# Altium schematic sheet Configuration_JTAG.SchDoc
size B; SheetNumber: 7; SheetTotal: 11
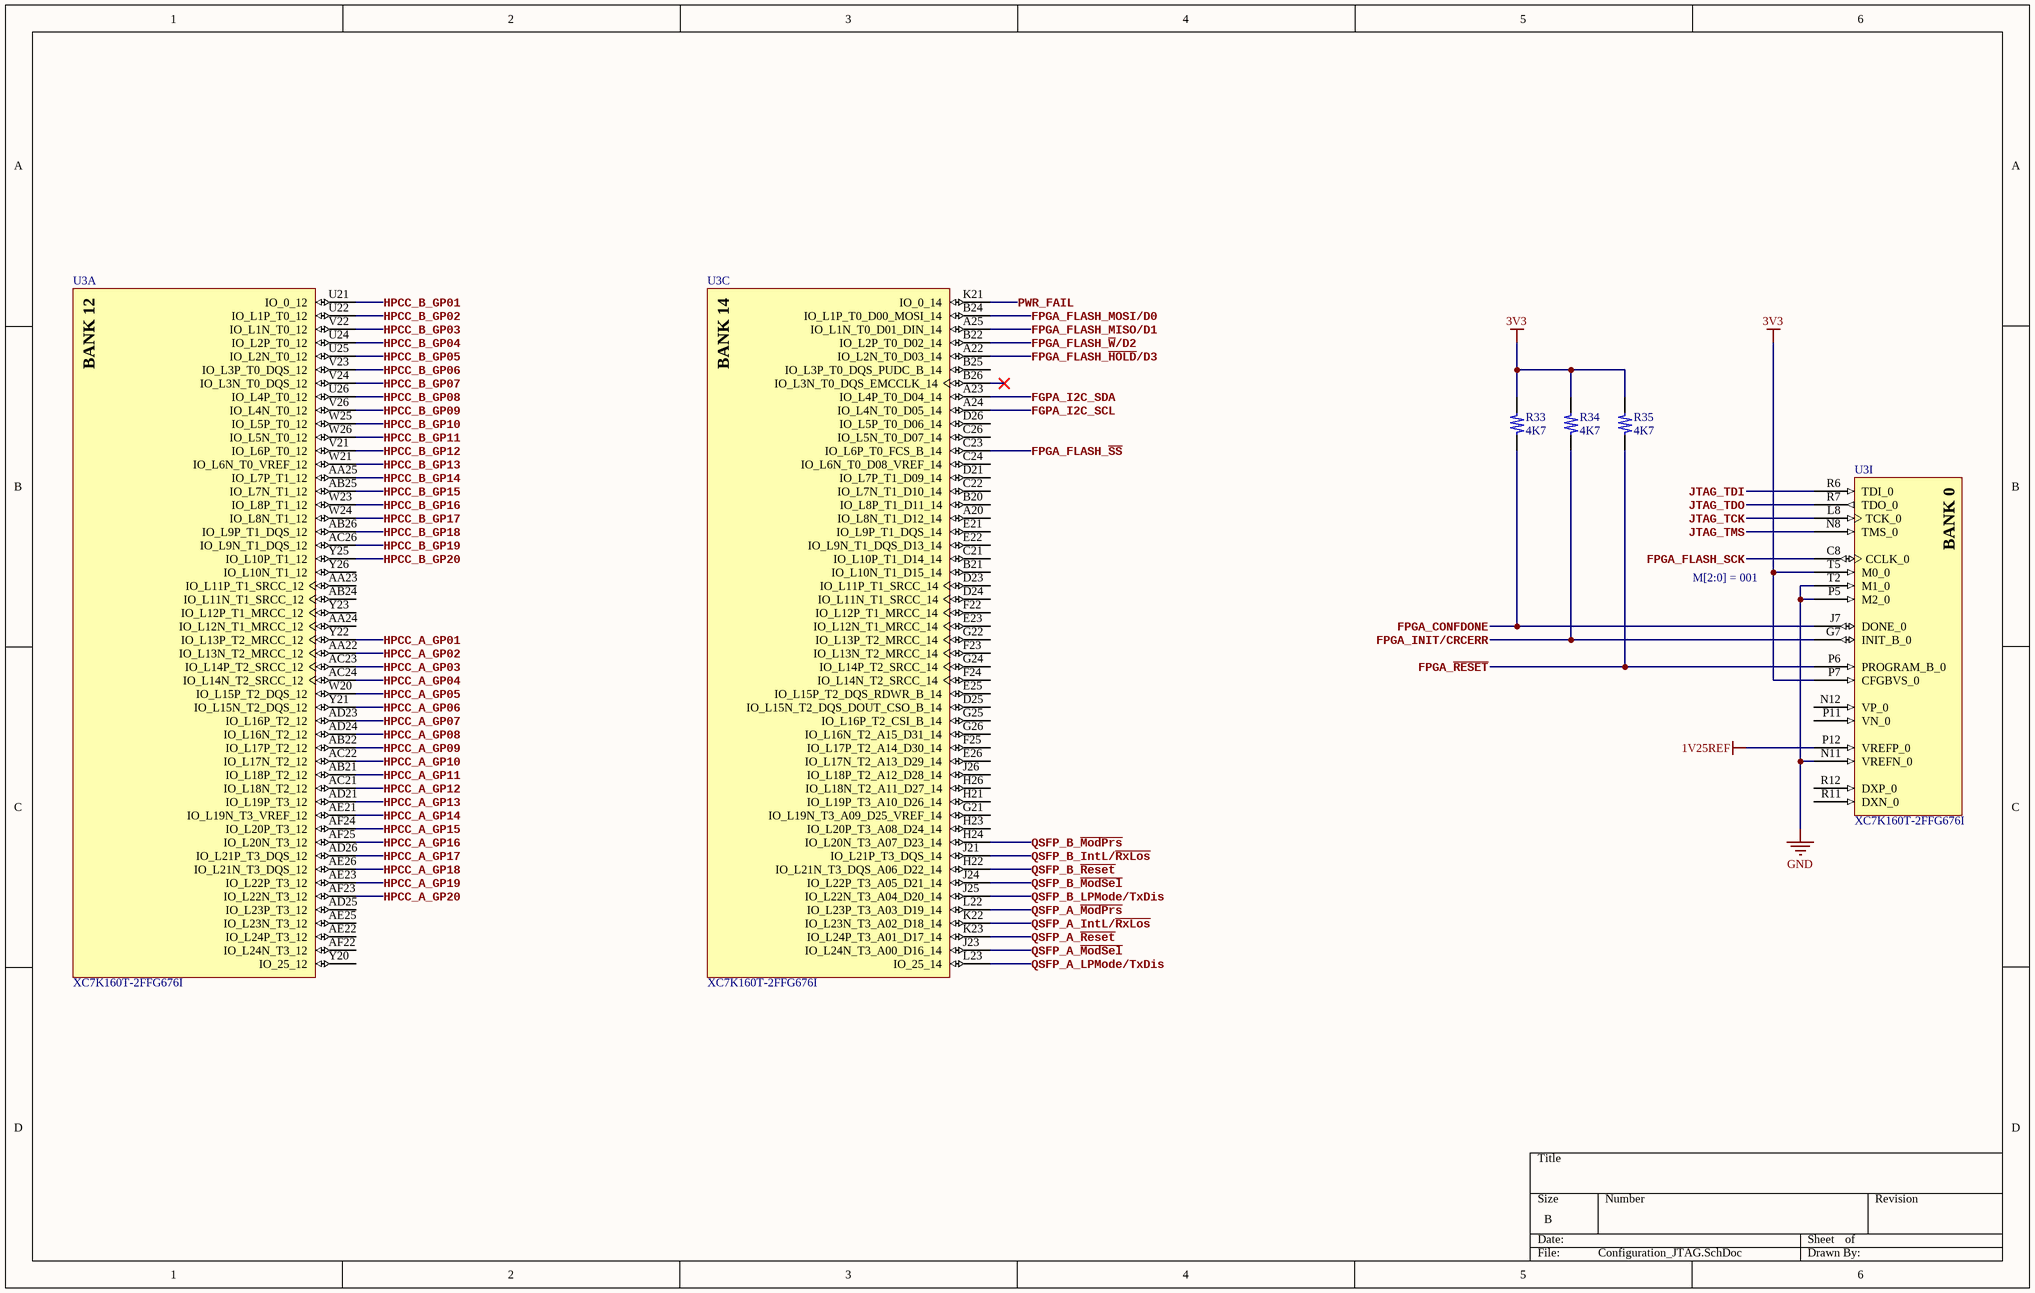
[diagram p0: Configuration_JTAG.SchDoc]

## Parts
R33  4K7  [R_0402_Generic]
R34  4K7  [R_0402_Generic]
R35  4K7  [R_0402_Generic]
U3  XC7K160T-2FFG676I  [FFG676_(XC7K160T-2FFG676I)]  (parts A,C,I of 14)

## Nets
1V25REF: U3.P12(VREFP_0)
3V3: R33.2 R34.2 R35.2 U3.P7(CFGBVS_0) U3.T5(M0_0)
GND: U3.N11(VREFN_0) U3.P5(M2_0) U3.T2(M1_0)
FGPA_I2C_SCL: U3.A24(IO_L4N_T0_D05_14)
FGPA_I2C_SDA: U3.A23(IO_L4P_T0_D04_14)
FPGA_CONFDONE: R33.1 U3.J7(DONE_0)
FPGA_FLASH_~{HOLD}/D3: U3.A22(IO_L2N_T0_D03_14)
FPGA_FLASH_MISO/D1: U3.A25(IO_L1N_T0_D01_DIN_14)
FPGA_FLASH_MOSI/D0: U3.B24(IO_L1P_T0_D00_MOSI_14)
FPGA_FLASH_~{SS}: U3.C23(IO_L6P_T0_FCS_B_14)
FPGA_FLASH_SCK: U3.C8(CCLK_0)
FPGA_FLASH_~{W}/D2: U3.B22(IO_L2P_T0_D02_14)
FPGA_INIT/CRCERR: R34.1 U3.G7(INIT_B_0)
FPGA_~{RESET}: R35.1 U3.P6(PROGRAM_B_0)
HPCC_A_GP01: U3.Y22(IO_L13P_T2_MRCC_12)
HPCC_A_GP02: U3.AA22(IO_L13N_T2_MRCC_12)
HPCC_A_GP03: U3.AC23(IO_L14P_T2_SRCC_12)
HPCC_A_GP04: U3.AC24(IO_L14N_T2_SRCC_12)
HPCC_A_GP05: U3.W20(IO_L15P_T2_DQS_12)
HPCC_A_GP06: U3.Y21(IO_L15N_T2_DQS_12)
HPCC_A_GP07: U3.AD23(IO_L16P_T2_12)
HPCC_A_GP08: U3.AD24(IO_L16N_T2_12)
HPCC_A_GP09: U3.AB22(IO_L17P_T2_12)
HPCC_A_GP10: U3.AC22(IO_L17N_T2_12)
HPCC_A_GP11: U3.AB21(IO_L18P_T2_12)
HPCC_A_GP12: U3.AC21(IO_L18N_T2_12)
HPCC_A_GP13: U3.AD21(IO_L19P_T3_12)
HPCC_A_GP14: U3.AE21(IO_L19N_T3_VREF_12)
HPCC_A_GP15: U3.AF24(IO_L20P_T3_12)
HPCC_A_GP16: U3.AF25(IO_L20N_T3_12)
HPCC_A_GP17: U3.AD26(IO_L21P_T3_DQS_12)
HPCC_A_GP18: U3.AE26(IO_L21N_T3_DQS_12)
HPCC_A_GP19: U3.AE23(IO_L22P_T3_12)
HPCC_A_GP20: U3.AF23(IO_L22N_T3_12)
HPCC_B_GP01: U3.U21(IO_0_12)
HPCC_B_GP02: U3.U22(IO_L1P_T0_12)
HPCC_B_GP03: U3.V22(IO_L1N_T0_12)
HPCC_B_GP04: U3.U24(IO_L2P_T0_12)
HPCC_B_GP05: U3.U25(IO_L2N_T0_12)
HPCC_B_GP06: U3.V23(IO_L3P_T0_DQS_12)
HPCC_B_GP07: U3.V24(IO_L3N_T0_DQS_12)
HPCC_B_GP08: U3.U26(IO_L4P_T0_12)
HPCC_B_GP09: U3.V26(IO_L4N_T0_12)
HPCC_B_GP10: U3.W25(IO_L5P_T0_12)
HPCC_B_GP11: U3.W26(IO_L5N_T0_12)
HPCC_B_GP12: U3.V21(IO_L6P_T0_12)
HPCC_B_GP13: U3.W21(IO_L6N_T0_VREF_12)
HPCC_B_GP14: U3.AA25(IO_L7P_T1_12)
HPCC_B_GP15: U3.AB25(IO_L7N_T1_12)
HPCC_B_GP16: U3.W23(IO_L8P_T1_12)
HPCC_B_GP17: U3.W24(IO_L8N_T1_12)
HPCC_B_GP18: U3.AB26(IO_L9P_T1_DQS_12)
HPCC_B_GP19: U3.AC26(IO_L9N_T1_DQS_12)
HPCC_B_GP20: U3.Y25(IO_L10P_T1_12)
JTAG_TCK: U3.L8(TCK_0)
JTAG_TDI: U3.R6(TDI_0)
JTAG_TDO: U3.R7(TDO_0)
JTAG_TMS: U3.N8(TMS_0)
PWR_FAIL: U3.K21(IO_0_14)
QSFP_A_IntL/~{RxLos}: U3.K22(IO_L23N_T3_A02_D18_14)
QSFP_A_LPMode/TxDis: U3.L23(IO_25_14)
QSFP_A_~{ModPrs}: U3.L22(IO_L23P_T3_A03_D19_14)
QSFP_A_~{ModSel}: U3.J23(IO_L24N_T3_A00_D16_14)
QSFP_A_~{Reset}: U3.K23(IO_L24P_T3_A01_D17_14)
QSFP_B_IntL/~{RxLos}: U3.J21(IO_L21P_T3_DQS_14)
QSFP_B_LPMode/TxDis: U3.J25(IO_L22N_T3_A04_D20_14)
QSFP_B_~{ModPrs}: U3.H24(IO_L20N_T3_A07_D23_14)
QSFP_B_~{ModSel}: U3.J24(IO_L22P_T3_A05_D21_14)
QSFP_B_~{Reset}: U3.H22(IO_L21N_T3_DQS_A06_D22_14)

Not connected (* = marked no-connect by the designer): U3 A20(IO_L8N_T1_D12_14) AA23(IO_L11P_T1_SRCC_12) AA24(IO_L12N_T1_MRCC_12) AB24(IO_L11N_T1_SRCC_12) AD25(IO_L23P_T3_12) AE22(IO_L24P_T3_12) AE25(IO_L23N_T3_12) AF22(IO_L24N_T3_12) B20(IO_L8P_T1_D11_14) B21(IO_L10N_T1_D15_14) B25(IO_L3P_T0_DQS_PUDC_B_14) B26(IO_L3N_T0_DQS_EMCCLK_14)* C21(IO_L10P_T1_D14_14) C22(IO_L7N_T1_D10_14) C24(IO_L6N_T0_D08_VREF_14) C26(IO_L5N_T0_D07_14) D21(IO_L7P_T1_D09_14) D23(IO_L11P_T1_SRCC_14) D24(IO_L11N_T1_SRCC_14) D25(IO_L15N_T2_DQS_DOUT_CSO_B_14) D26(IO_L5P_T0_D06_14) E21(IO_L9P_T1_DQS_14) E22(IO_L9N_T1_DQS_D13_14) E23(IO_L12N_T1_MRCC_14) E25(IO_L15P_T2_DQS_RDWR_B_14) E26(IO_L17N_T2_A13_D29_14) F22(IO_L12P_T1_MRCC_14) F23(IO_L13N_T2_MRCC_14) F24(IO_L14N_T2_SRCC_14) F25(IO_L17P_T2_A14_D30_14) G21(IO_L19N_T3_A09_D25_VREF_14) G22(IO_L13P_T2_MRCC_14) G24(IO_L14P_T2_SRCC_14) G25(IO_L16P_T2_CSI_B_14) G26(IO_L16N_T2_A15_D31_14) H21(IO_L19P_T3_A10_D26_14) H23(IO_L20P_T3_A08_D24_14) H26(IO_L18N_T2_A11_D27_14) J26(IO_L18P_T2_A12_D28_14) N12(VP_0) P11(VN_0) R11(DXN_0) R12(DXP_0) Y20(IO_25_12) Y23(IO_L12P_T1_MRCC_12) Y26(IO_L10N_T1_12)

## Notes on the sheet
- BANK 0
- M[2:0] = 001
- (in symbol XC7K160T, part A) BANK 12
- (in symbol XC7K160T, part C) BANK 14

## Library data of the parts
R33-R35 = R_0402_Generic: RES 4.7K OHM 1% 1/16W 0402
U3 = XC7K160T: Kintex-7 FPGA, 400 User I/Os, 8 GTX, 676-Ball BGA, Speed Grade 2, Industrial Grade, Pb-Free; Manufacturer: Xilinx; Speed Grade: -2; GTX: 8; SelectIO HP: 150; SelectIO HR: 250; Code_JEDEC: MS-034-AAL-1; ComponentLink2URL: http://www.xilinx.com/support/documentation/user_guides/ug865-Zynq-7000-Pkg-Pinout.pdf; ComponentLink1Description: Datasheet; PackageReference: FFG676; PackageVersion: Rev 1.1; RoHS: Pb-Free; ComponentLink2Description: Package Specification; DatasheetVersion: v1.12; PartNumber: XC7K160T-2FFG676I; Generic Part Number: XC7K160T; PackageDescription: Flip-Chip BGA, Body 27 x 27 mm, 1.0 mm Pitch; ComponentLink1URL: http://www.xilinx.com/support/documentation/data_sheets/ds180_7Series_Overview.pdf; Mounting Technology: Surface Mount